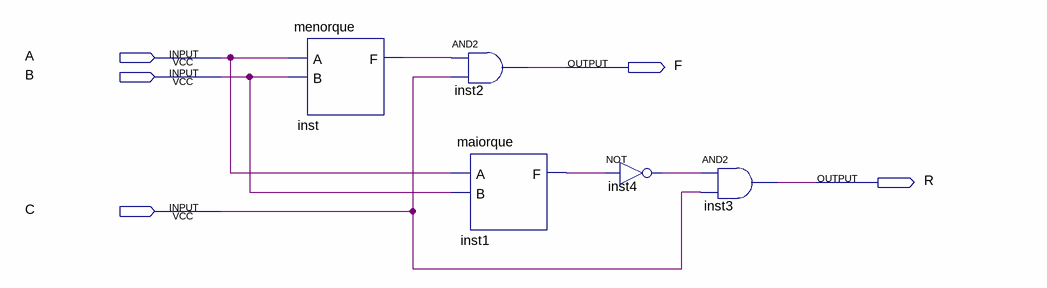
[diagram p0: schematic sheet]
// Quartus schematic menorrab.bdf as structural Verilog: 5 symbols, 5 pins
module menorrab (
  input  A,
  input  B,
  input  C,
  output F,
  output R
);

  wire inst1_f, inst4_out, inst_f;

  menorque inst (.A(A), .B(B), .F(inst_f));
  and inst2 (F, inst_f, C);
  maiorque inst1 (.A(A), .B(B), .F(inst1_f));
  not inst4 (inst4_out, inst1_f);
  and inst3 (R, inst4_out, C);
endmodule
